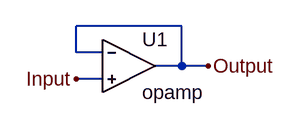
[diagram p0: schematic Voltage_follower.asc]
Voltage_follower.asc, the LTspice schematic file:
Version 4
SHEET 1 880 680
WIRE 272 112 144 112
WIRE 144 144 144 112
WIRE 176 144 144 144
WIRE 272 160 272 112
WIRE 272 160 240 160
WIRE 304 160 272 160
WIRE 176 176 144 176
FLAG 144 176 Input
FLAG 304 160 Output
SYMBOL OpAmps\\opamp 208 96 R0
SYMATTR InstName U1

The netlist it stands for:
* Voltage_follower.asc
XU1 Output Input Output opamp Aol=100K GBW=10Meg  ; pins invin noninvin out
.backanno
.end